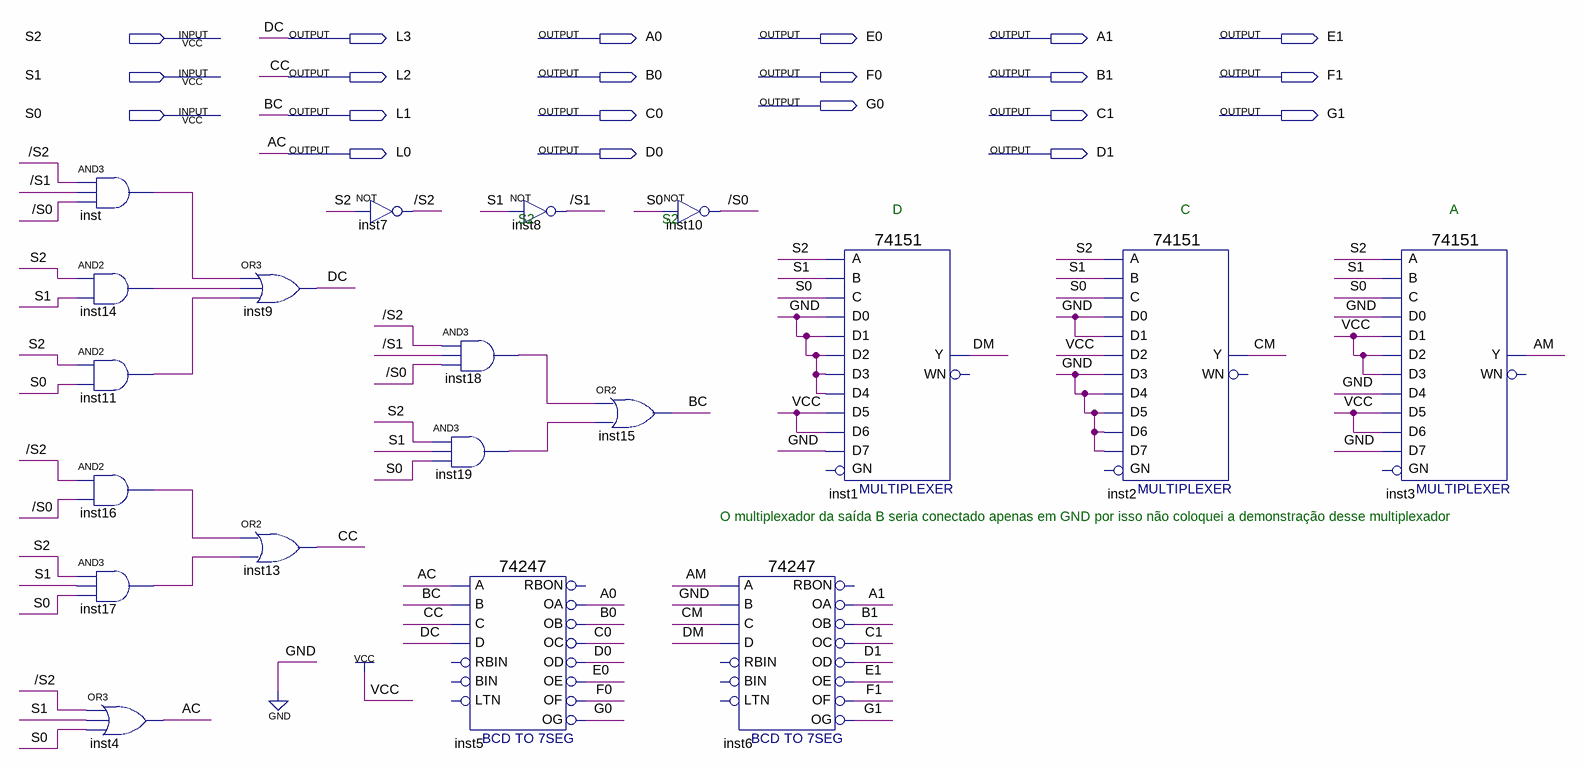
[diagram p0: schematic sheet]
// Quartus schematic projeto1.bdf as structural Verilog: 19 symbols, 21 pins
module projeto1 (
  input  S2,
  input  S1,
  input  S0,
  output L3,
  output A0,
  output E0,
  output A1,
  output E1,
  output L2,
  output B0,
  output F0,
  output B1,
  output F1,
  output G0,
  output L1,
  output C0,
  output C1,
  output G1,
  output L0,
  output D0,
  output D1
);

  wire \/S0 , \/S1 , \/S2 , AM, CM, DM, inst11_out, inst14_out, inst16_out, inst17_out, inst18_out,
       inst19_out, inst_out;

  and inst (inst_out, \/S2 , \/S1 , \/S0 );
  and inst14 (inst14_out, S2, S1);
  and inst11 (inst11_out, S2, S0);
  and inst16 (inst16_out, \/S2 , \/S0 );
  and inst17 (inst17_out, S2, S1, S0);
  or inst4 (L0, \/S2 , S1, S0);
  or inst9 (L3, inst_out, inst14_out, inst11_out);
  or inst13 (L2, inst16_out, inst17_out);
  not inst7 (\/S2 , S2);
  and inst18 (inst18_out, \/S2 , \/S1 , \/S0 );
  and inst19 (inst19_out, S2, S1, S0);
  \74247  inst5 (
    .A(L0), .B(L1), .C(L2), .D(L3), .OF(F0), .OC(C0), .OD(D0), .OE(E0), .OA(A0), .OB(B0), .OG(G0));  // open: LTN, BIN, RBIN, RBON
  not inst8 (\/S1 , S1);
  or inst15 (L1, inst18_out, inst19_out);
  not inst10 (\/S0 , S0);
  \74247  inst6 (
    .A(AM), .B(1'b0), .C(CM), .D(DM), .OF(F1), .OC(C1), .OD(D1), .OE(E1), .OA(A1), .OB(B1), .OG(G1));  // open: LTN, BIN, RBIN, RBON
  \74151  inst1 (
    .C(S0), .B(S1), .A(S2), .D5(1'b1), .D0(1'b0), .D1(1'b0), .D4(1'b0), .D3(1'b0), .D2(1'b0), .D6(1'b1),
    .D7(1'b0), .Y(DM));  // open: GN, WN
  \74151  inst2 (
    .C(S0), .B(S1), .A(S2), .D5(1'b0), .D0(1'b0), .D1(1'b0), .D4(1'b0), .D3(1'b0), .D2(1'b1), .D6(1'b0),
    .D7(1'b0), .Y(CM));  // open: GN, WN
  \74151  inst3 (
    .C(S0), .B(S1), .A(S2), .D5(1'b1), .D0(1'b0), .D1(1'b1), .D4(1'b0), .D3(1'b1), .D2(1'b1), .D6(1'b1),
    .D7(1'b0), .Y(AM));  // open: GN, WN

  // Other names for the same wires on the sheet: AC = L0; BC = L1; CC = L2; DC = L3

  // Notes on the sheet:
  //   D
  //   C
  //   A
  //   S2
  //   S2
  //   O multiplexador da saída B seria conectado apenas em GND por isso não coloquei a demonstração desse multiplexador
endmodule
